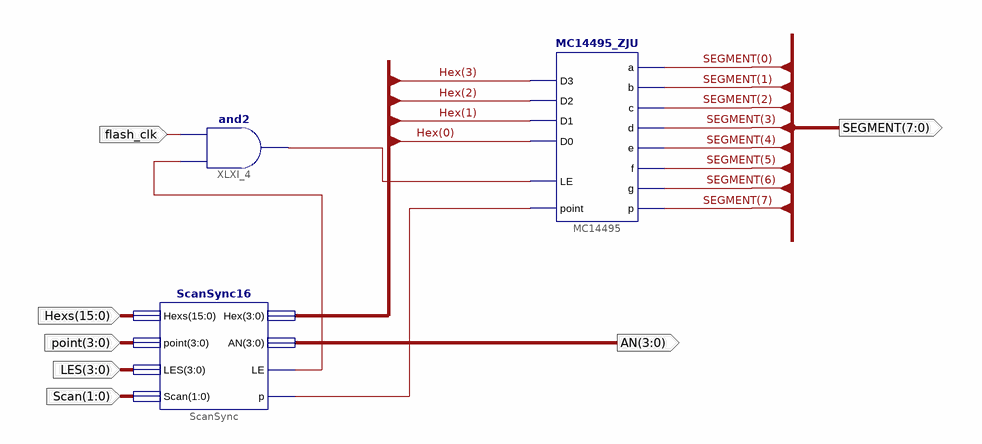
[diagram p0: schematic sheet 1]
// Xilinx ISE schematic Seg7_Dev16.sch (kintex7) as structural Verilog: 3 symbols, 7 ports
module Seg7_Dev16 (
  input  [15:0] Hexs,
  input  [3:0] point,
  input  [3:0] LES,
  input  [1:0] Scan,
  input  flash_clk,
  output [3:0] AN,
  output [7:0] SEGMENT
);

  wire XLXN_5, XLXN_12, XLXN_13;
  wire [3:0] Hex;

  MC14495_ZJU MC14495 (
    .D0(Hex[0]), .D1(Hex[1]), .D2(Hex[2]), .D3(Hex[3]), .p(SEGMENT[7]), .g(SEGMENT[6]), .f(SEGMENT[5]),
    .e(SEGMENT[4]), .d(SEGMENT[3]), .c(SEGMENT[2]), .b(SEGMENT[1]), .a(SEGMENT[0]), .point(XLXN_5),
    .LE(XLXN_13));
  ScanSync16 ScanSync (
    .Hexs(Hexs), .point(point), .LES(LES), .Scan(Scan), .Hex(Hex), .AN(AN), .LE(XLXN_12), .p(XLXN_5));
  and XLXI_4 (XLXN_13, XLXN_12, flash_clk);
endmodule
